# Altium schematic sheet GPS.SchDoc
size A3; PageSetup: Record=PageOptions|CenterHorizontal=True|CenterVertical=True|PrintScale=0.49|XCorrection=1.00|YCorrection=1.00|PrintKind=0|BorderSize=5000000|LeftOffset=0|BottomOffset=0|Orientation=2|PaperLength=1000|PaperWidth=1000|Scale=100|PaperSource=7|PrintQuality=600|MediaType=1|DitherType=10|PaperKind=A3|PrintScaleMode=1; SheetTitle: Sheet Title
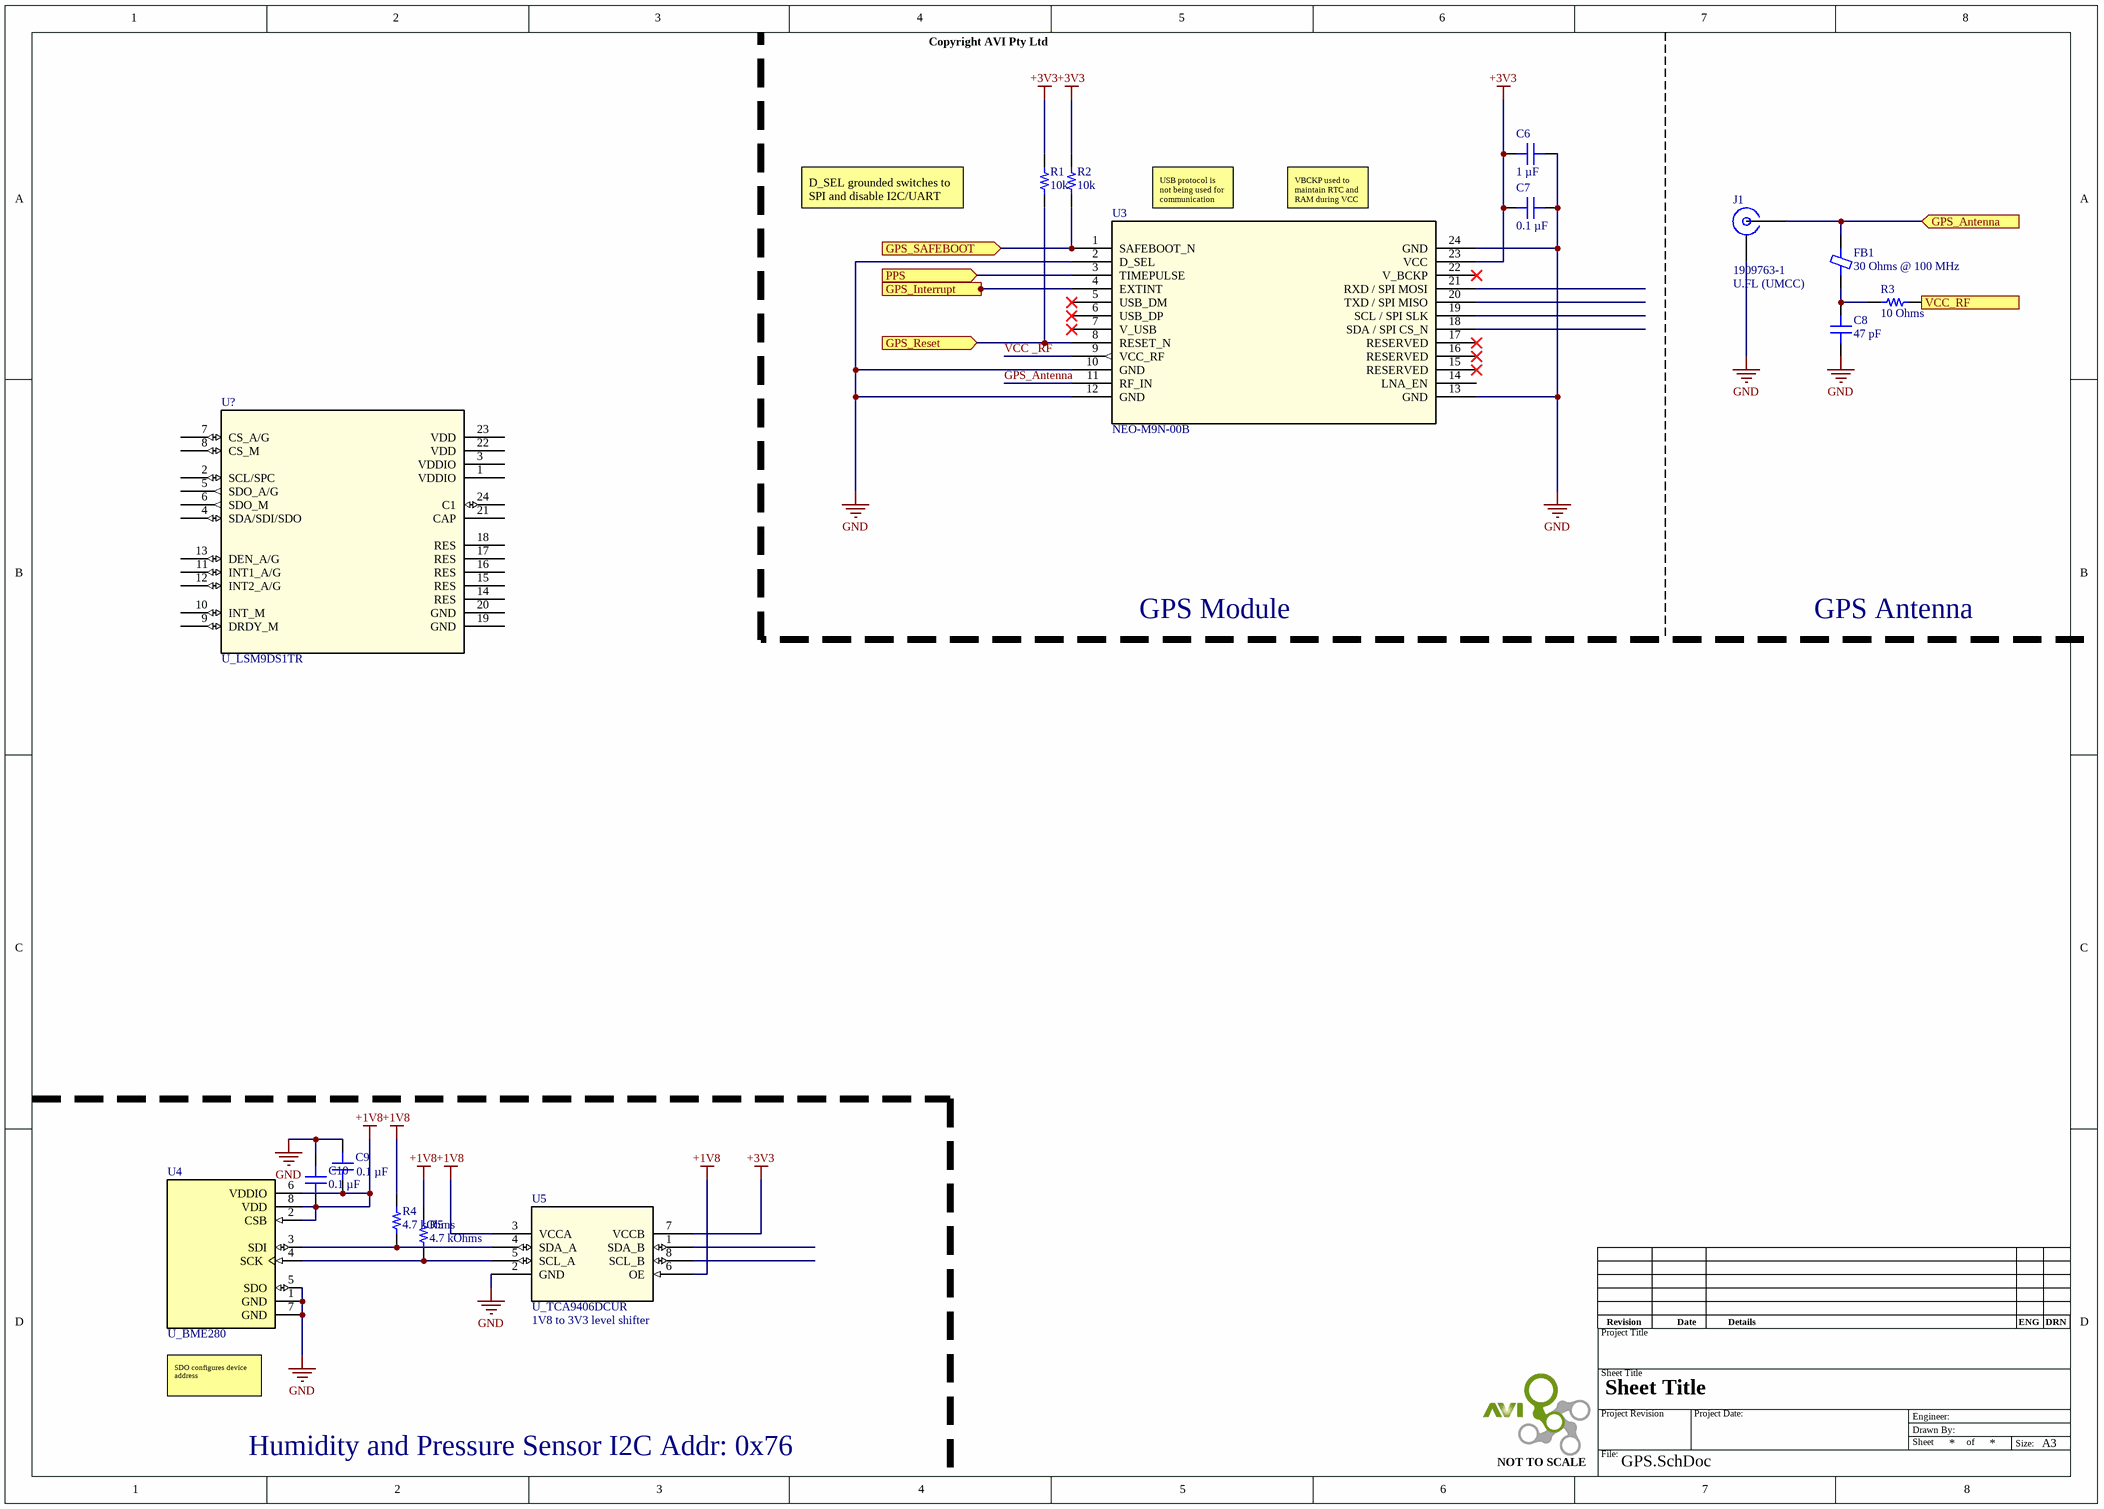
[diagram p0: GPS.SchDoc]

## Parts
C6  1 µF  [CAP 0402_1005]
C7  0.1 µF  [CAP 0402_1005]
C8  47 pF  [CAP 0402_1005]
C9  0.1 µF  [CAP 0402_1005]
C10  0.1 µF  [CAP 0402_1005]
FB1  30 Ohms @ 100 MHz  [FER 0402_1005]
J1  1909763-1  Connector Style: U.FL (UMCC)  [TE C-1909763]
R1  10k  [RES 0402_1005]
R2  10k  [RES 0402_1005]
R3  10 Ohms  [RES 0402_1005]
R4  4.7 kOhms  [RES 0201_0603]
R5  4.7 kOhms  [RES 0201_0603]
U3  NEO-M9N-00B  [SMT_9N-00B_UBL]
U4  U_BME280  [PSON65P250X250X100-8N]
U5  U_TCA9406DCUR  [DCU8]
U?  U_LSM9DS1TR  [LGA-24_3X3P5X1_STM]

## Ports
GPS_Antenna (in), GPS_Interrupt (in), GPS_Reset (in), GPS_SAFEBOOT (in), PPS (in), VCC_RF (in)

## Nets
+1V8: C9.2 C10.2 R4.2 R5.2 U4.2(CSB) U4.6(VDDIO) U4.8(VDD) U5.3(VCCA) U5.6(OE)
+3V3: C6.1 C7.2 R1.1 R2.1 U3.23(VCC) U5.7(VCCB)
GND: C6.2 C7.1 C8.1 C9.1 C10.1 J1.G(GND) U3.2(D_SEL) U3.10(GND) U3.12(GND) U3.13(GND) U3.24(GND) U4.1(GND) U4.5(SDO) U4.7(GND) U5.2(GND)
GPS_Antenna: U3.11(RF_IN)
GPS_Antenna: FB1.2 J1.S(SIGNAL) ; port GPS_Antenna  [a separate net that carries the same name]
GPS_Interrupt: U3.4(EXTINT) ; port GPS_Interrupt
GPS_Reset: R1.2 U3.8(RESET_N) ; port GPS_Reset
GPS_SAFEBOOT: R2.2 U3.1(SAFEBOOT_N) ; port GPS_SAFEBOOT
PPS: U3.3(TIMEPULSE) ; port PPS
VCC _RF: U3.9(VCC_RF)
VCC_RF: R3.2 ; port VCC_RF
NetC8_2: C8.2 FB1.1 R3.1
NetR4_1: R4.1 U4.3(SDI) U5.4(SDA_A)
NetR5_1: R5.1 U4.4(SCK) U5.5(SCL_A)

Not connected (* = marked no-connect by the designer): U3 5(USB_DM)* 6(USB_DP)* 7(V_USB)* 14(LNA_EN) 15(RESERVED)* 16(RESERVED)* 17(RESERVED)* 18(SDA_/_SPI_CS_N) 19(SCL_/_SPI_SLK) 20(TXD_/_SPI_MISO) 21(RXD_/_SPI_MOSI) 22(V_BCKP)*; U5 1(SDA_B) 8(SCL_B); U? 1(VDDIO) 2(SCL/SPC) 3(VDDIO) 4(SDA/SDI/SDO) 5(SDO_A/G) 6(SDO_M) 7(CS_A/G) 8(CS_M) 9(DRDY_M) 10(INT_M) 11(INT1_A/G) 12(INT2_A/G) 13(DEN_A/G) 14(RES) 15(RES) 16(RES) 17(RES) 18(RES) 19(GND) 20(GND) 21(CAP) 22(VDD) 23(VDD) 24(C1)

## Notes on the sheet
- D_SEL grounded switches to SPI and disable I2C/UART
- (near U3) USB protocol is not being used for communication
- (near U3) VBCKP used to maintain RTC and RAM during VCC outage. Not being used as MCU does complete logging.
- GPS Module
- GPS Antenna
- (near U5) 1V8 to 3V3 level shifter
- (near U4) SDO configures device address
- Humidity and Pressure Sensor I2C Addr: 0x76
- 1
- 2
- 3
- 4
- Copyright AVI Pty Ltd
- 5
- 6
- 7
- 8
- A
- B
- C
- D
- Revision
- Date
- Details
- ENG
- DRN
- Project Title
- Sheet Title
- File:
- Project Revision
- Project Date:
- Engineer:
- Sheet
- Drawn By:
- of
- Size:
- A3
- NOT TO SCALE

## Library data of the parts
C6 = KGM05AR50G105KH: CAP CER 1UF 4V X5R 0402; manufacturer: KYOCERA AVX; Tolerance: ±10%; Part Number: KGM05AR50G105KH; Value: 1 µF; Applications: General Purpose; Capacitance: 1 µF; componentlink1description: Datasheet; componentlink1url: https://datasheets.kyocera-avx.com/cx5r.pdf; componentlink2description: DigiKey Link; componentlink2url: https://www.digikey.com/en/products/detail/kyocera-avx/KGM05AR50G105KH/3079858; Device Package: 0402 (1005 Metric); lastupdated: 9/02/2024 8:03:45 PM; Lifecycle Status: Active; Minimum Order: 1; Mounting Type: Surface Mount, MLCC; Operating Temperature: -55°C ~ 85°C; Package / Case: 0402 (1005 Metric); packaging: TapeAndReel; partid: 51052; Part Status: Active; price: 0.07; series: KGM - X5R; Size / Dimension: 0.039" L x 0.020" W (1.00mm x 0.50mm); Supplier 1: DigiKey; Supplier Part Number 1: 478-KGM05AR50G105KHCT-ND; Temperature Coefficient: X5R; Thickness (Max): 0.022" (0.55mm); Voltage - Rated: 4V
C7 C9 C10 = CL05B104KP5VPNC: CAP CER 100NF 10V X7R 0402; manufacturer: Samsung Electro-Mechanics; Tolerance: ±10%; Part Number: CL05B104KP5VPNC; Value: 0.1 µF; Applications: Automotive; Capacitance: 0.1 µF; componentlink1description: Datasheet; componentlink1url: https://mm.digikey.com/Volume0/opasdata/d220001/medias/docus/5458/CL05B104KP5VPNC_Spec.pdf; componentlink2description: DigiKey Link; componentlink2url: https://www.digikey.com/en/products/detail/samsung-electro-mechanics/CL05B104KP5VPNC/20498482; Device Package: 0402 (1005 Metric); lastupdated: 9/02/2024 8:03:17 PM; Lifecycle Status: Active; Minimum Order: 1; Mounting Type: Surface Mount, MLCC; Operating Temperature: -55°C ~ 125°C; Package / Case: 0402 (1005 Metric); packaging: TapeAndReel; partid: 56690; price: 0.01; Ratings: AEC-Q200; series: CL; Size / Dimension: 0.039" L x 0.020" W (1.00mm x 0.50mm); Supplier 1: DigiKey; Supplier Part Number 1: 1276-CL05B104KP5VPNCCT-ND; Temperature Coefficient: X7R; Thickness (Max): 0.022" (0.55mm); Voltage - Rated: 10V
C8 = C0402C470J4GAC7867: CAP CER 47PF 16V NP0 0402; manufacturer: KEMET; Temperature Coefficient: C0G, NP0; Tolerance: ±5%; Part Number: C0402C470J4GAC7867; Value: 47 pF; Applications: General Purpose; Capacitance: 47 pF; componentlink1description: Datasheet; componentlink1url: https://api.kemet.com/component-edge/download/datasheet/C0402C470J4GACTU.pdf; componentlink2description: DigiKey Link; componentlink2url: https://www.digikey.com/en/products/detail/kemet/C0402C470J4GAC7867/2196712; Device Package: 0402 (1005 Metric); Features: Low ESL; lastupdated: 9/02/2024 8:04:38 PM; Lifecycle Status: Active; Minimum Order: 1; Mounting Type: Surface Mount, MLCC; Operating Temperature: -55°C ~ 125°C; Package / Case: 0402 (1005 Metric); packaging: TapeAndReel; partid: 1744; Part Status: Active; price: 0.05; series: SMD Comm C0G; Size / Dimension: 0.039" L x 0.020" W (1.00mm x 0.50mm); Supplier 1: DigiKey; Supplier Part Number 1: 399-14453-1-ND; Thickness (Max): 0.022" (0.55mm); Voltage - Rated: 16V
FB1 = BLM15PE300SH1D: FERRITE BEAD 30 OHM 0402 1LN; Manufacturer: Murata Electronics; Current Rating (Max): 2.3A; DC Resistance (DCR) (Max): 35mOhm; Filter Type: Power Line; Number of Lines: 1; Part Number: BLM15PE300SH1D; ComponentLink1Description: Datasheet; ComponentLink1URL: https://www.murata.com/products/productdata/8796743696414/QNFA9103.pdf; ComponentLink2Description: DigiKey Link; ComponentLink2URL: https://www.digikey.com/en/products/detail/murata-electronics/BLM15PE300SH1D/14012391; Device Package: 0402 (1005 Metric); Height (Max): 0.022" (0.55mm); Impedance @ Frequency: 30 Ohms @ 100 MHz; LastUpdated: 11/03/2024 7:42:36 AM; Lifecycle Status: Active; Minimum Order: 1; Mounting Type: Surface Mount; Operating Temperature: -55°C ~ 125°C; Package / Case: 0402 (1005 Metric); Packaging: TapeAndReel; PartId: 2564; Part Status: Active; Price: 0.07; Ratings: AEC-Q200; Series: BLM; Size / Dimension: 0.039" L x 0.020" W (1.00mm x 0.50mm); Supplier 1: DigiKey; Supplier Part Number 1: 490-BLM15PE300SH1DCT-ND; Value: 30 Ohms @ 100 MHz
J1 = 1909763-1: CONN UMCC JACK STR 50OHM SMD; Manufacturer: TE Connectivity AMP Connectors; Connector Type: Jack, Male Pin; Contact Termination: Solder; Frequency - Max: 6 GHz; Number of Ports: 1; Part Number: 1909763-1; ComponentLink1Description: Datasheet; ComponentLink1URL: https://www.te.com/commerce/DocumentDelivery/DDEController?Action=srchrtrv&DocNm=1909763&DocType=Customer+Drawing&DocLang=English; ComponentLink2Description: DigiKey Link; ComponentLink2URL: https://www.digikey.com/en/products/detail/te-connectivity-amp-connectors/1909763-1/4731728; Fastening Type: Snap-On; Housing Color: Ivory; Impedance: 50Ohm; LastUpdated: 29/06/2022 6:17:07 PM; Lifecycle Status: Active; Minimum Order: 1; Mounting Type: Surface Mount; Packaging: TapeAndReel; Part Status: Active; Price: 0.23; Series: -; Shield Termination: Solder; Supplier 1: DigiKey; Supplier Part Number 1: A118077CT-ND
R1 R2 = RP73PF1E10KBTD: RES 10K OHM 0.1% 1/10W 0402; Manufacturer: TE Connectivity Passive Product; Power (Watts): 0.1W, 1/10W; Resistance: 10 kOhms; Temperature Coefficient: ±25ppm/°C; Part Number: RP73PF1E10KBTD; Value: 10k; ComponentLink1Description: Datasheet; ComponentLink1URL: https://www.te.com/commerce/DocumentDelivery/DDEController?Action=srchrtrv&DocNm=1773272&DocType=DS&DocLang=English; ComponentLink2Description: DigiKey Link; ComponentLink2URL: https://www.digikey.com/en/products/detail/te-connectivity-passive-product/RP73PF1E10KBTD/8260957; Composition: Thin Film; Device Package: 0402 (1005 Metric); Height - Seated (Max): 0.014" (0.35mm); LastUpdated: 9/02/2024 8:30:24 PM; Lifecycle Status: Active; Minimum Order: 1; Number of Terminations: 2; Operating Temperature: -55°C ~ 155°C; Package / Case: 0402 (1005 Metric); Packaging: TapeAndReel; PartId: 2434; Part Status: Active; Price: 0.08; Series: RP73, Holsworthy; Size / Dimension: 0.039" L x 0.020" W (1.00mm x 0.50mm); Supplier 1: DigiKey; Supplier Part Number 1: A127415CT-ND; Supplier Device Package: 0402; Tolerance: ±0.1%
R3 = CH0402-10RJFT: CH 0402 10U 5% F TR E2; Manufacturer: Vishay Sfernice; Power (Watts): 0.05W, 1/20W; Temperature Coefficient: ±100ppm/°C; Part Number: CH0402-10RJFT; Value: 10 Ohms; ComponentLink1Description: Datasheet; ComponentLink1URL: http://www.vishay.com/docs/53014/ch.pdf; ComponentLink2Description: DigiKey Link; ComponentLink2URL: http://digikey.com/product-detail/en/vishay-sfernice/CH0402-10RJFT/716-1233-1-ND/10294670; Composition: Thin Film; Device Package: 0402 (1005 Metric); Features: RF, High Frequency; Height - Seated (Max): 0.025" (0.63mm); LastUpdated: 9/02/2024 8:30:09 PM; Lifecycle Status: Active; Minimum Order: 1; Number of Terminations: 2; Operating Temperature: -55°C ~ 155°C; Package / Case: 0402 (1005 Metric); Packaging: TapeAndReel; PartId: 5958; Part Status: Active; Price: 4.15; Resistance: 10 Ohms; Series: CH; Size / Dimension: 0.039" L x 0.024" W (1.00mm x 0.60mm); Supplier 1: DigiKey; Supplier Part Number 1: 716-1233-1-ND; Supplier Device Package: 0402; Tolerance: ±5%
R4 R5 = CRCW02014K70FKED: RES SMD 4.7K OHM 1% 1/20W 0201; Manufacturer: Vishay Dale; Power (Watts): 0.05W, 1/20W; Temperature Coefficient: ±100ppm/°C; Part Number: CRCW02014K70FKED; Value: 4.7 kOhms; ComponentLink1Description: Datasheet; ComponentLink1URL: http://www.vishay.com/docs/20052/crcw0201e3.pdf; ComponentLink2Description: DigiKey Link; ComponentLink2URL: https://www.digikey.com/en/products/detail/vishay-dale/CRCW02014K70FKED/1968069; Composition: Thick Film; Device Package: 0201 (0603 Metric); Height - Seated (Max): 0.010" (0.26mm); LastUpdated: 11/03/2024 7:14:07 AM; Lifecycle Status: Active; Minimum Order: 1; Number of Terminations: 2; Operating Temperature: -55°C ~ 155°C; Package / Case: 0201 (0603 Metric); Packaging: TapeAndReel; PartId: 37; Part Status: Active; Price: 0.02; Resistance: 4.7 kOhms; Series: CRCW; Size / Dimension: 0.024" L x 0.012" W (0.60mm x 0.30mm); Supplier 1: DigiKey; Supplier Part Number 1: 541-4.70KAABCT-ND; Supplier Device Package: 0201; Tolerance: ±1%
U3 = U_NEO-M9N-00B: *; Mfr_Name: Ublox; RefDes: RefDes; Type: Type
U4 = U_BME280: Humidity, Pressure, Temperature 0 ~ 100% RH I2C, SPI ±3% 1 s Surface Mount; MP: BME280; Package: None; Availability: Unavailable; Value: *; Price: None
U5 = U_TCA9406DCUR: No Description Available; Mfr_Name: Texas Instruments; RefDes: RefDes; Type: Type
U? = U_LSM9DS1TR: No Description Available; Mfr_Name: STMicroelectronics; RefDes: RefDes; Type: Type